# Altium schematic sheet Extruder Fin System.SchDoc
size A
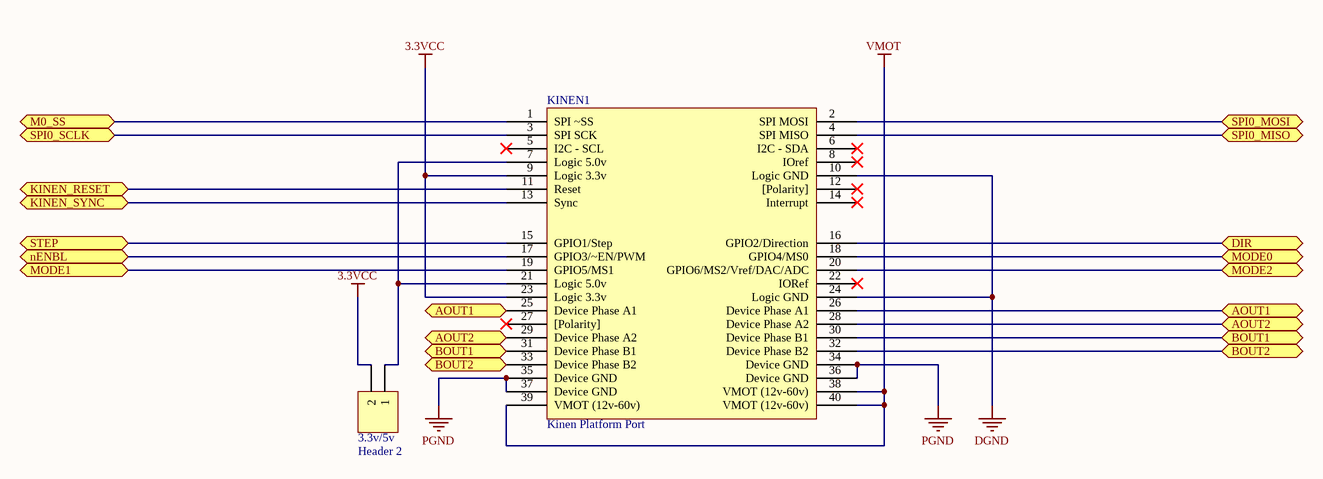
[diagram p0: Extruder Fin System.SchDoc]

## Parts
3.3v/5v  Header 2  [HDR1X2]
KINEN1  Kinen Platform Port  [Kinen Port]

## Ports
AOUT1, AOUT2, BOUT1, BOUT2, DIR, KINEN_RESET, KINEN_SYNC, M0_SS, MODE0, MODE1, MODE2, nENBL, SPI0_MISO, SPI0_MOSI, SPI0_SCLK, STEP

## Nets
3.3VCC: 3.3v/5v.2 KINEN1.9(Logic_3.3v) KINEN1.23(Logic_3.3v)
DGND: KINEN1.10(Logic_GND) KINEN1.24(Logic_GND)
PGND: KINEN1.34(Device_GND) KINEN1.35(Device_GND) KINEN1.36(Device_GND) KINEN1.37(Device_GND)
VMOT: KINEN1.38(VMOT_(12v-60v)) KINEN1.39(VMOT_(12v-60v)) KINEN1.40(VMOT_(12v-60v))
AOUT1: KINEN1.25(Device_Phase_A1) KINEN1.26(Device_Phase_A1) ; port AOUT1
AOUT2: KINEN1.28(Device_Phase_A2) KINEN1.29(Device_Phase_A2) ; port AOUT2
BOUT1: KINEN1.30(Device_Phase_B1) KINEN1.31(Device_Phase_B1) ; port BOUT1
BOUT2: KINEN1.32(Device_Phase_B2) KINEN1.33(Device_Phase_B2) ; port BOUT2
DIR: KINEN1.16(GPIO2/Direction) ; port DIR
KINEN_RESET: KINEN1.11(Reset) ; port KINEN_RESET
KINEN_SYNC: KINEN1.13(Sync) ; port KINEN_SYNC
M0_SS: KINEN1.1(SPI_~SS) ; port M0_SS
MODE0: KINEN1.18(GPIO4/MS0) ; port MODE0
MODE1: KINEN1.19(GPIO5/MS1) ; port MODE1
MODE2: KINEN1.20(GPIO6/MS2/Vref/DAC/ADC) ; port MODE2
nENBL: KINEN1.17(GPIO3/~EN/PWM) ; port nENBL
SPI0_MISO: KINEN1.4(SPI_MISO) ; port SPI0_MISO
SPI0_MOSI: KINEN1.2(SPI_MOSI) ; port SPI0_MOSI
SPI0_SCLK: KINEN1.3(SPI_SCK) ; port SPI0_SCLK
STEP: KINEN1.15(GPIO1/Step) ; port STEP
Net3.3v/5v_1: 3.3v/5v.1 KINEN1.7(Logic_5.0v) KINEN1.21(Logic_5.0v)

Not connected (* = marked no-connect by the designer): KINEN1 5(I2C_-_SCL)* 6(I2C_-_SDA)* 8(IOref)* 12([Polarity])* 14(Interrupt)* 22(IORef)* 27([Polarity])*

## Library data of the parts
3.3v/5v = Header 2: Header, 2-Pin; LatestRevisionDate: 17-Jul-2002; LatestRevisionNote: Re-released for DXP Platform.; Publisher: Altium Limited
KINEN1 = Kinen Port